# Altium schematic sheet Main485.SchDoc
size A4
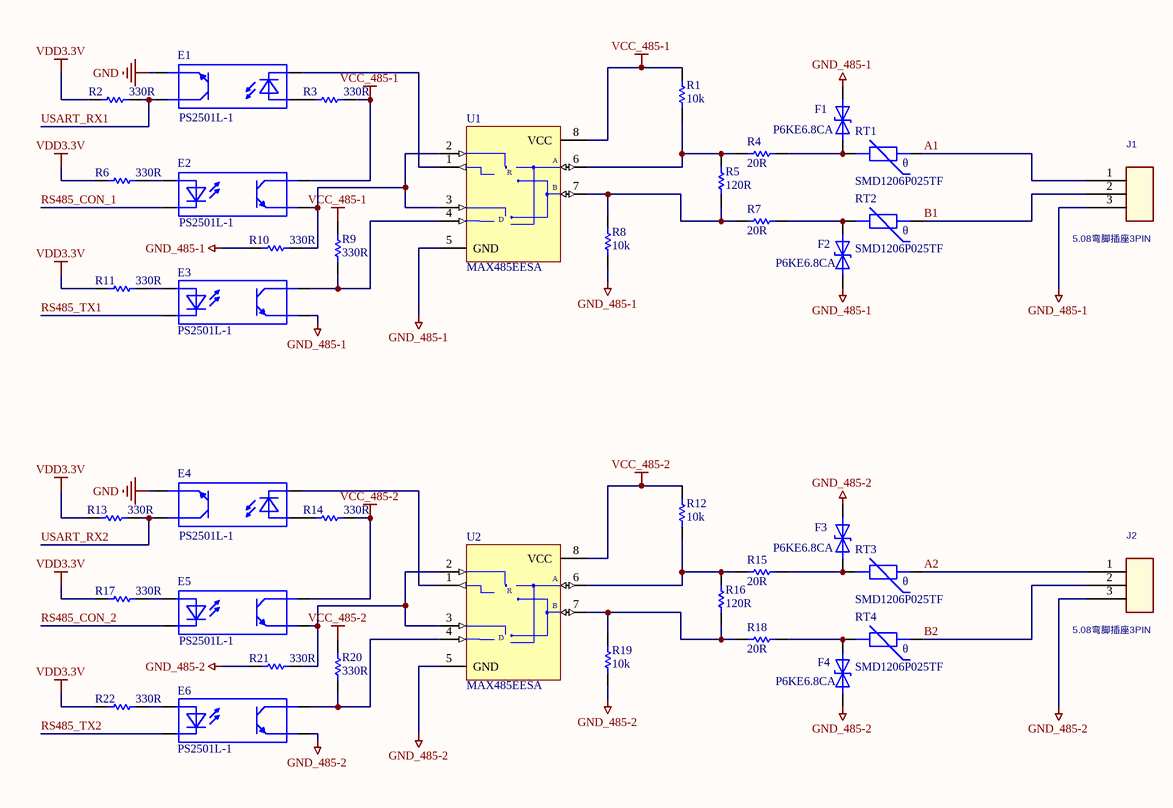
[diagram p0: Main485.SchDoc]

## Parts
E1  PS2501L-1  [NEC2501]
E2  PS2501L-1  [NEC2501]
E3  PS2501L-1  [NEC2501]
E4  PS2501L-1  [NEC2501]
E5  PS2501L-1  [NEC2501]
E6  PS2501L-1  [NEC2501]
F1  P6KE6.8CA  [P6KE6,8CA]
F2  P6KE6.8CA  [P6KE6,8CA]
F3  P6KE6.8CA  [P6KE6,8CA]
F4  P6KE6.8CA  [P6KE6,8CA]
J1  5.08弯脚插座3PIN  [JIEKE_3PX508]
J2  5.08弯脚插座3PIN  [JIEKE_3PX508]
R1  value 10k  [0805]  (hidden comment: Res Semi)
R2  value 330R  [0805]  (hidden comment: Res Semi)
R3  value 330R  [0805]  (hidden comment: Res Semi)
R4  value 20R  [0805]  (hidden comment: Res Semi)
R5  value 120R  [0805]  (hidden comment: Res Semi)
R6  value 330R  [0805]  (hidden comment: Res Semi)
R7  value 20R  [0805]  (hidden comment: Res Semi)
R8  value 10k  [0805]  (hidden comment: Res Semi)
R9  value 330R  [0805]  (hidden comment: Res Semi)
R10  value 330R  [0805]  (hidden comment: Res Semi)
R11  value 330R  [0805]  (hidden comment: Res Semi)
R12  value 10k  [0805]  (hidden comment: Res Semi)
R13  value 330R  [0805]  (hidden comment: Res Semi)
R14  value 330R  [0805]  (hidden comment: Res Semi)
R15  value 20R  [0805]  (hidden comment: Res Semi)
R16  value 120R  [0805]  (hidden comment: Res Semi)
R17  value 330R  [0805]  (hidden comment: Res Semi)
R18  value 20R  [0805]  (hidden comment: Res Semi)
R19  value 10k  [0805]  (hidden comment: Res Semi)
R20  value 330R  [0805]  (hidden comment: Res Semi)
R21  value 330R  [0805]  (hidden comment: Res Semi)
R22  value 330R  [0805]  (hidden comment: Res Semi)
RT1  SMD1206P025TF  [1206]
RT2  SMD1206P025TF  [1206]
RT3  SMD1206P025TF  [1206]
RT4  SMD1206P025TF  [1206]
U1  MAX485EESA  [NSO8]
U2  MAX485EESA  [NSO8]

## Nets
GND: E1.3 E4.3
GND_485-1: E3.3 F1.1 F2.2 J1.3 R8.2 R10.2 U1.5(GND)
GND_485-2: E6.3 F3.1 F4.2 J2.3 R19.2 R21.2 U2.5(GND)
VCC_485-1: E2.4 R1.1 R3.1 R9.1 U1.8(VCC)
VCC_485-2: E5.4 R12.1 R14.1 R20.1 U2.8(VCC)
VDD3.3V: R2.2 R6.2 R11.2 R13.2 R17.2 R22.2
A1: J1.1 RT1.2
A2: J2.1 RT3.2
B1: J1.2 RT2.2
B2: J2.2 RT4.2
RS485_CON_1: E2.2
RS485_CON_2: E5.2
RS485_TX1: E3.2
RS485_TX2: E6.2
USART_RX1: E1.4 R2.1
USART_RX2: E4.4 R13.1
NetE1_1: E1.1 R3.2
NetE1_2: E1.2 U1.1(RO)
NetE2_1: E2.1 R6.1
NetE2_3: E2.3 R10.1 U1.2(~{RE}) U1.3(DE)
NetE3_1: E3.1 R11.1
NetE3_4: E3.4 R9.2 U1.4(DI)
NetE4_1: E4.1 R14.2
NetE4_2: E4.2 U2.1(RO)
NetE5_1: E5.1 R17.1
NetE5_3: E5.3 R21.1 U2.2(~{RE}) U2.3(DE)
NetE6_1: E6.1 R22.1
NetE6_4: E6.4 R20.2 U2.4(DI)
NetF1_2: F1.2 R4.2 RT1.1
NetF2_1: F2.1 R7.2 RT2.1
NetF3_2: F3.2 R15.2 RT3.1
NetF4_1: F4.1 R18.2 RT4.1
NetR1_2: R1.2 R4.1 R5.1 U1.6(A)
NetR5_2: R5.2 R7.1 R8.1 U1.7(B)
NetR12_2: R12.2 R15.1 R16.1 U2.6(A)
NetR16_2: R16.2 R18.1 R19.1 U2.7(B)

## Notes on the sheet
- (in symbol MAX485ESA) R; D
- (in symbol PTC) θ

## Library data of the parts
E1-E6 = OPT: 光耦
F1-F4 = TVS: 快速瞬变二极管
J1 J2 = CON3: TOLERANCE: =J65_TOLERANCE
R1-R22 = Res Semi: Semiconductor Resistor; Published: 8-Jun-2000; LatestRevisionDate: 17-Jul-2002; LatestRevisionNote: Re-released for DXP Platform.; PackageReference: AXIAL-0.5; Publisher: Altium Limited
RT1-RT4 = PTC: 热敏电阻
U1 U2 = MAX485ESA: Low-Power, Slew-Rate-Limited RS-485/RS-422 Transceiver; Code - JEDEC: MS-012-AA; Code - IPC: SO8; Published: 16-Jan-2001; Revision: 17-Jul-2002: Re-released for DXP Platform.; Datasheet: Latest Revision: Feb-1996; Package Reference: NSO8; Publisher: Altium Limited